# Altium schematic sheet PowerSupply1.SchDoc
size A4
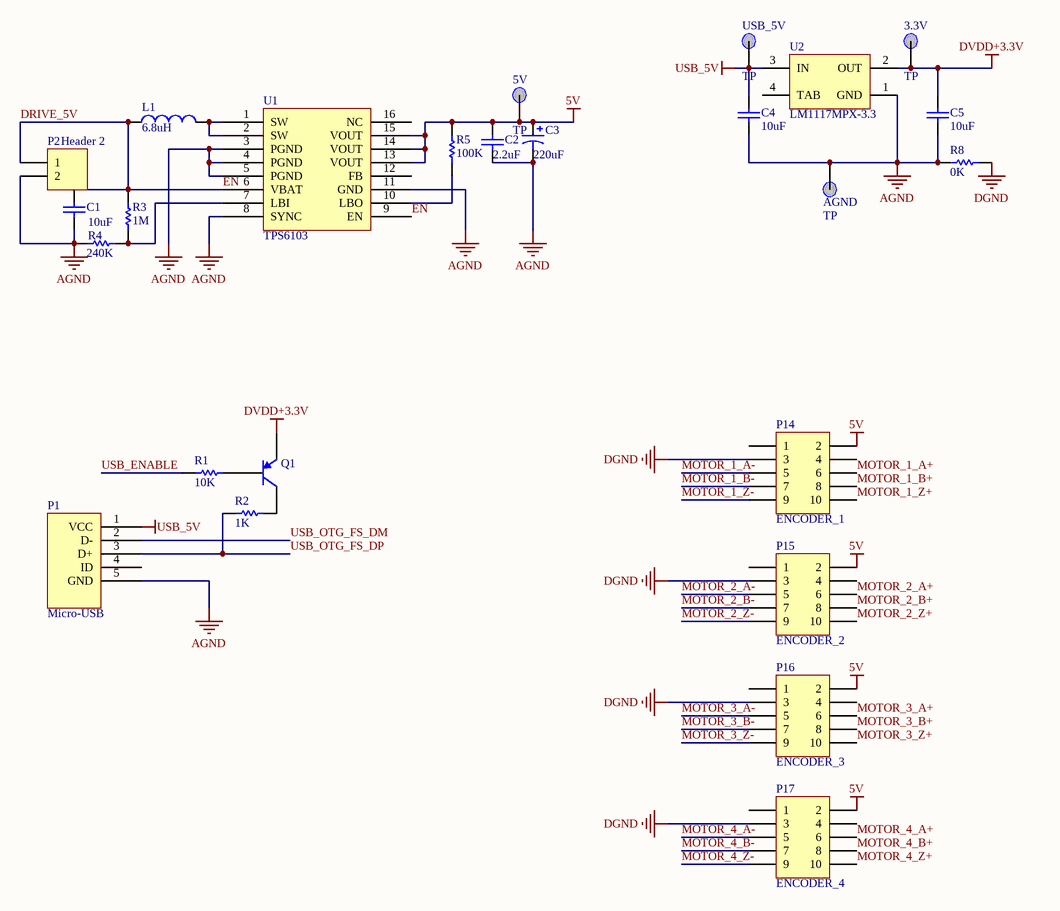
[diagram p0: PowerSupply1.SchDoc]

## Parts
3.3V  TP  [TestPort]
5V  TP  [TestPort]
AGND  TP  [TestPort]
C1  10uF  [1608[0603]]
C2  2.2uF  [1608[0603]]
C3  220uF  [6TPF220M5L]
C4  10uF  [1608[0603]]
C5  10uF  [1608[0603]]
L1  6.8uH  [B82464G4682M]
P1  Micro-USB  [Micro-USB]
P2  Header 2  [HDR1X2]
P14  ENCODER_1  [MHDR2X5]
P15  ENCODER_2  [MHDR2X5]
P16  ENCODER_3  [MHDR2X5]
P17  ENCODER_4  [MHDR2X5]
Q1  PNP  [SOT-23B_N]  (value not drawn)
R1  10K  [J1-0603]
R2  1K  [RES[0402]]
R3  1M  [J1-0603]
R4  240K  [J1-0603]
R5  100K  [J1-0603]
R8  0K  [J1-0603]
U1  TPS6103  [TI_PWP_G16]
U2  LM1117MPX-3.3  [SOT230-4N]
USB_5V  TP  [TestPort]

## Nets
5V: 5V.0 C2.2 C3.1 P14.2 P15.2 P16.2 P17.2 R5.2 U1.13(VOUT) U1.14(VOUT) U1.15(VOUT)
AGND: AGND.0 C1.1 C2.1 C3.2 C4.2 C5.2 P1.5(GND) P2.2 R4.1 R8.1 U1.3(PGND) U1.4(PGND) U1.5(PGND) U1.8(SYNC) U1.11(GND) U2.1(GND)
DGND: P14.3 P15.3 P16.3 P17.3 R8.2
DVDD+3.3V: 3.3V.0 C5.1 Q1.3(E) U2.2(OUT)
USB_5V: C4.1 P1.1(VCC) U2.3(IN) USB_5V.0
DRIVE_5V: C1.2 L1.1 P2.1 R3.2 U1.6(VBAT) U1.9(EN)  [also labelled EN]
MOTOR_1_A+: P14.6
MOTOR_1_A-: P14.5
MOTOR_1_B+: P14.8
MOTOR_1_B-: P14.7
MOTOR_1_Z+: P14.10
MOTOR_1_Z-: P14.9
MOTOR_2_A+: P15.6
MOTOR_2_A-: P15.5
MOTOR_2_B+: P15.8
MOTOR_2_B-: P15.7
MOTOR_2_Z+: P15.10
MOTOR_2_Z-: P15.9
MOTOR_3_A+: P16.6
MOTOR_3_A-: P16.5
MOTOR_3_B+: P16.8
MOTOR_3_B-: P16.7
MOTOR_3_Z+: P16.10
MOTOR_3_Z-: P16.9
MOTOR_4_A+: P17.6
MOTOR_4_A-: P17.5
MOTOR_4_B+: P17.8
MOTOR_4_B-: P17.7
MOTOR_4_Z+: P17.10
MOTOR_4_Z-: P17.9
USB_ENABLE: R1.1
USB_OTG_FS_DM: P1.2(D-)
USB_OTG_FS_DP: P1.3(D+) R2.2
NetL1_2: L1.2 U1.1(SW) U1.2(SW)
NetQ1_1: Q1.1(C) R2.1
NetQ1_2: Q1.2(B) R1.2
NetR3_1: R3.1 R4.2 U1.7(LBI)
NetR5_1: R5.1 U1.10(LBO)

Not connected (* = marked no-connect by the designer): P1 4(ID); P14 1 4; P15 1 4; P16 1 4; P17 1 4; U1 12(FB) 16(NC); U2 4(TAB)

## Library data of the parts
3.3V 5V AGND USB_5V = TestPoint
C1 C2 C4 C5 = Cap: Capacitor; Published: 8-Jun-2000; LatestRevisionDate: 17-Jul-2002; LatestRevisionNote: Re-released for DXP Platform.; PackageReference: RAD-0.3; Publisher: Altium Limited; PackageDescription: Radial Cap, Thru-Hole; 2 Leads; 0.3 in Pin Spacing
  C1 C4 C5: Value: 10uF
  C2: Value: 2.2uF
C3 = Cap Pol1: Polarized Capacitor (Radial); Published: 8-Jun-2000; LatestRevisionDate: 17-Jul-2002; LatestRevisionNote: Re-released for DXP Platform.; PackageReference: RB7.6-15; Publisher: Altium Limited; PackageDescription: Polarized Capacitor (Radial); 2 Leads; Value: 220uF
L1 = Inductor: Code_IEC: 1005; Published: 8-Jun-2000; LatestRevisionDate: 29-May-2009; LatestRevisionNote: IPC-7351 Footprint Added.; PackageReference: 0402-A; Publisher: Altium Limited; PackageDescription: Chip Inductor; Code_JEITA: 0402; Value: 6.8uH
P2 = Header 2: Header, 2-Pin; LatestRevisionDate: 17-Jul-2002; LatestRevisionNote: Re-released for DXP Platform.; Publisher: Altium Limited
P14-P17 = Header 5X2: Header, 5-Pin, Dual row; LatestRevisionDate: 17-Jul-2002; LatestRevisionNote: Re-released for DXP Platform.; Publisher: Altium Limited
Q1 = PNP: PNP Bipolar Transistor; Published: 8-Jun-2000; LatestRevisionDate: 29-May-2009; LatestRevisionNote: IPC-7351 Footprint Added.; PackageVersion: Aug-1999; PackageReference: SOT-23B; Publisher: Altium Limited; PackageDescription: 3-Pin SOT-23 Package 0.95 mm Pitch, 2.4 mm Lead Span
R1-R5 R8 = Res1: Resistor; Published: 8-Jun-2000; LatestRevisionDate: 17-Jul-2002; LatestRevisionNote: Re-released for DXP Platform.; PackageReference: AXIAL-0.3; Publisher: Altium Limited; PackageDescription: Axial Device, Thru-Hole; 2 Leads; 0.3 in Pin Spacing
  R1: Value: 10K
  R2: Value: 1K
  R3: Value: 1M
  R4: Value: 240K
  R5: Value: 100K
  R8: Value: 0K
U2 = LM1117MPX-3.3: 800mA Low-Dropout Linear Regulator, 4-pin SOT-223; Manufacturer: National Semiconductor; PackageTopMarking: XYTT*N05A; PowerWise: N; CompType: LDO IC; Published: 1-Mar-2010; DatasheetVersion: Apr-2006; PackageVersion: revB, Apr-2003; PackageReference: MP04A; Publisher: Altium Limited; PackageDescription: Molded SOT-223, 6.50 x 3.56 x 1.6mm Body, 4 Lead, 2.3mm Pitch; Supplier 1: Farnell; Supplier Part Number 1: 1652313; PartNumber: LM1117MPX-3.3; RoHS: N; PinCount: 4; Code_JEDEC: TO-261-AA; Code_IPC: SOT223-4; ComponentLink1Description: LM1117 Datasheet; ComponentLink1URL: http://www.national.com/ds/LM/LM1117.pdf; ComponentLink2Description: LM1117 Web Page; ComponentLink2URL: http://www.national.com/pf/LM/LM1117.html; ComponentLink3Description: MP04A Package Page; ComponentLink3URL: http://www.national.com/packaging/folders/mp04a.html